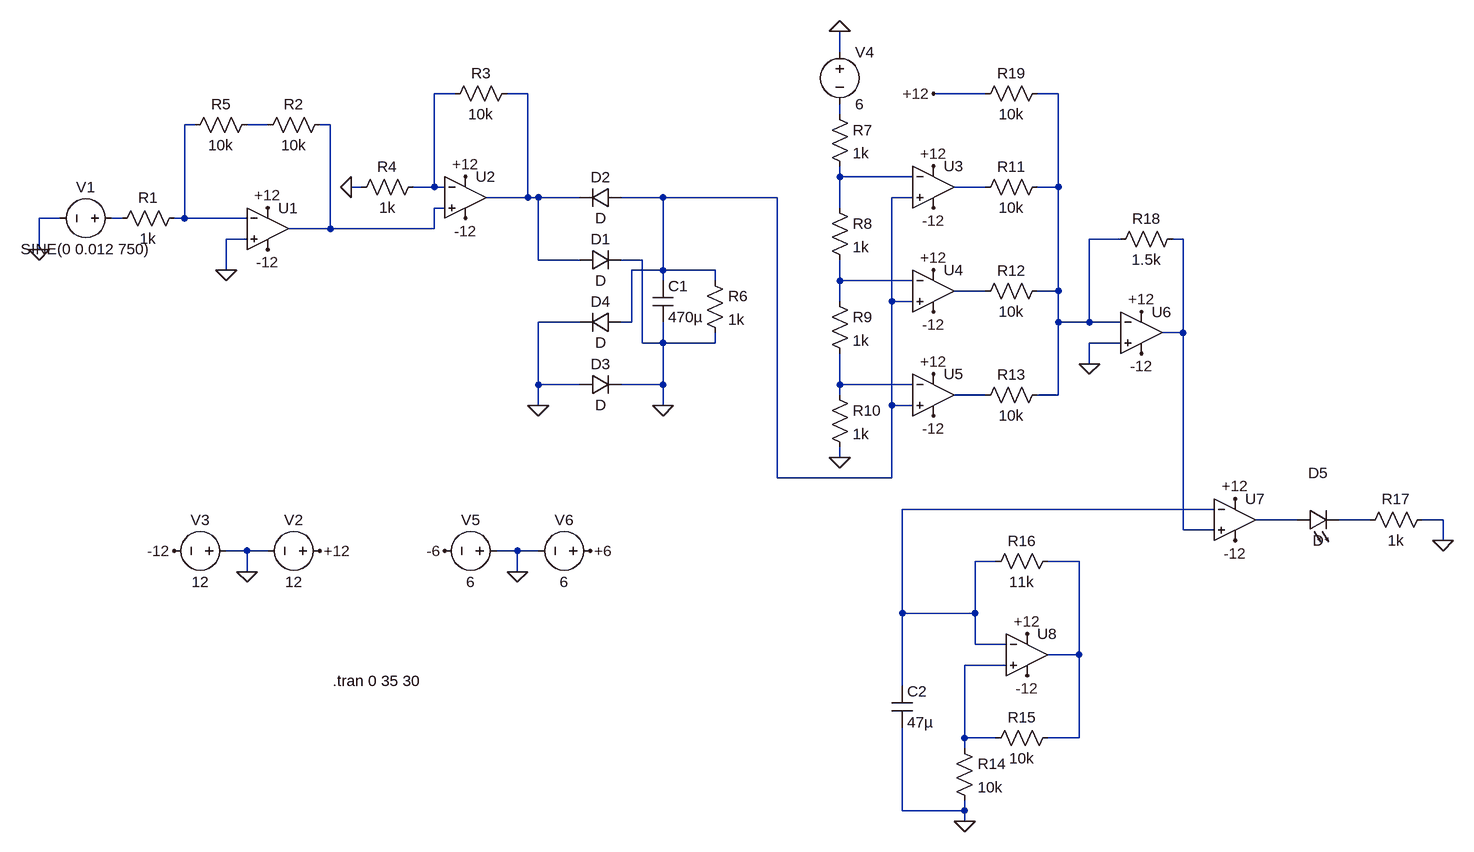
[diagram p0: schematic term project.asc]
term project.asc, the LTspice schematic file:
Version 4
SHEET 1 1892 1012
WIRE 944 -192 944 -224
WIRE 352 -128 320 -128
WIRE 464 -128 432 -128
WIRE 1168 -128 1088 -128
WIRE 1280 -128 1248 -128
WIRE 944 -96 944 -112
WIRE -48 -80 -64 -80
WIRE 64 -80 32 -80
WIRE 160 -80 144 -80
WIRE 944 0 944 -16
WIRE 1056 0 944 0
WIRE 208 16 192 16
WIRE 320 16 320 -128
WIRE 320 16 288 16
WIRE 336 16 320 16
WIRE 1168 16 1120 16
WIRE 1280 16 1280 -128
WIRE 1280 16 1248 16
WIRE 464 32 464 -128
WIRE 464 32 400 32
WIRE 480 32 464 32
WIRE 544 32 480 32
WIRE 672 32 608 32
WIRE 848 32 672 32
WIRE 1056 32 1024 32
WIRE 336 48 320 48
WIRE 944 48 944 0
WIRE -256 64 -288 64
WIRE -160 64 -176 64
WIRE -64 64 -64 -80
WIRE -64 64 -80 64
WIRE 32 64 -64 64
WIRE 160 80 160 -80
WIRE 160 80 96 80
WIRE 320 80 320 48
WIRE 320 80 160 80
WIRE 32 96 0 96
WIRE 1376 96 1328 96
WIRE 1472 96 1456 96
WIRE -288 112 -288 64
WIRE 480 128 480 32
WIRE 544 128 480 128
WIRE 640 128 608 128
WIRE 0 144 0 96
WIRE 672 144 672 32
WIRE 672 144 624 144
WIRE 752 144 672 144
WIRE 672 160 672 144
WIRE 752 160 752 144
WIRE 944 160 944 128
WIRE 1056 160 944 160
WIRE 1168 176 1120 176
WIRE 1280 176 1280 16
WIRE 1280 176 1248 176
WIRE 944 192 944 160
WIRE 1024 192 1024 32
WIRE 1056 192 1024 192
WIRE 544 224 480 224
WIRE 624 224 624 144
WIRE 624 224 608 224
WIRE 1280 224 1280 176
WIRE 1328 224 1328 96
WIRE 1328 224 1280 224
WIRE 1376 224 1328 224
WIRE 1472 240 1472 96
WIRE 1472 240 1440 240
WIRE 640 256 640 128
WIRE 672 256 672 224
WIRE 672 256 640 256
WIRE 752 256 752 240
WIRE 752 256 672 256
WIRE 1376 256 1328 256
WIRE 1328 288 1328 256
WIRE 480 320 480 224
WIRE 544 320 480 320
WIRE 672 320 672 256
WIRE 672 320 608 320
WIRE 944 320 944 272
WIRE 1056 320 944 320
WIRE 944 336 944 320
WIRE 1168 336 1120 336
WIRE 1280 336 1280 224
WIRE 1280 336 1248 336
WIRE 480 352 480 320
WIRE 672 352 672 320
WIRE 1024 352 1024 192
WIRE 1056 352 1024 352
WIRE 944 432 944 416
WIRE 848 464 848 32
WIRE 1024 464 1024 352
WIRE 1024 464 848 464
WIRE 1520 512 1040 512
WIRE 1648 528 1584 528
WIRE 1760 528 1712 528
WIRE 1872 528 1840 528
WIRE 1472 544 1472 240
WIRE 1520 544 1472 544
WIRE 1872 560 1872 528
WIRE 32 576 0 576
WIRE 64 576 32 576
WIRE 448 576 416 576
WIRE 480 576 448 576
WIRE 1184 592 1152 592
WIRE 1312 592 1264 592
WIRE 32 608 32 576
WIRE 448 608 448 576
WIRE 1040 672 1040 512
WIRE 1152 672 1152 592
WIRE 1152 672 1040 672
WIRE 1152 720 1152 672
WIRE 1200 720 1152 720
WIRE 1312 736 1312 592
WIRE 1312 736 1264 736
WIRE 1200 752 1136 752
WIRE 1040 784 1040 672
WIRE 1136 864 1136 752
WIRE 1184 864 1136 864
WIRE 1312 864 1312 736
WIRE 1312 864 1264 864
WIRE 1136 880 1136 864
WIRE 1040 976 1040 848
WIRE 1136 976 1136 960
WIRE 1136 976 1040 976
WIRE 1136 992 1136 976
FLAG -288 112 0
FLAG 192 16 0
FLAG 0 144 0
FLAG 32 608 0
FLAG 144 576 +12
FLAG 368 0 +12
FLAG 64 48 +12
FLAG -80 576 -12
FLAG 368 64 -12
FLAG 64 112 -12
FLAG 480 352 0
FLAG 672 352 0
FLAG 944 432 0
FLAG 944 -224 0
FLAG 1088 -16 +12
FLAG 1088 144 +12
FLAG 1088 304 +12
FLAG 1088 368 -12
FLAG 1088 208 -12
FLAG 1088 48 -12
FLAG 1328 288 0
FLAG 1136 992 0
FLAG 1232 768 -12
FLAG 1232 704 +12
FLAG 1552 496 +12
FLAG 448 608 0
FLAG 560 576 +6
FLAG 336 576 -6
FLAG 1408 272 -12
FLAG 1408 208 +12
FLAG 1552 560 -12
FLAG 1872 560 0
FLAG 1088 -128 +12
SYMBOL voltage -160 64 R90
WINDOW 0 -32 56 VBottom 2
WINDOW 3 32 56 VTop 2
WINDOW 123 0 0 Left 0
WINDOW 39 0 0 Left 0
SYMATTR InstName V1
SYMATTR Value SINE(0 0.012 750)
SYMBOL Opamps\\UniversalOpamp2 64 80 R0
SYMATTR InstName U1
SYMBOL Opamps\\UniversalOpamp2 368 32 R0
SYMATTR InstName U2
SYMBOL res -64 48 R90
WINDOW 0 0 56 VBottom 2
WINDOW 3 32 56 VTop 2
SYMATTR InstName R1
SYMATTR Value 1k
SYMBOL res 160 -96 R90
WINDOW 0 0 56 VBottom 2
WINDOW 3 32 56 VTop 2
SYMATTR InstName R2
SYMATTR Value 10k
SYMBOL res 448 -144 R90
WINDOW 0 0 56 VBottom 2
WINDOW 3 32 56 VTop 2
SYMATTR InstName R3
SYMATTR Value 10k
SYMBOL res 304 0 R90
WINDOW 0 0 56 VBottom 2
WINDOW 3 32 56 VTop 2
SYMATTR InstName R4
SYMATTR Value 1k
SYMBOL voltage 160 576 R90
WINDOW 0 -32 56 VBottom 2
WINDOW 3 32 56 VTop 2
SYMATTR InstName V2
SYMATTR Value 12
SYMBOL voltage 16 576 R90
WINDOW 0 -32 56 VBottom 2
WINDOW 3 32 56 VTop 2
SYMATTR InstName V3
SYMATTR Value 12
SYMBOL res 48 -96 R90
WINDOW 0 0 56 VBottom 2
WINDOW 3 32 56 VTop 2
SYMATTR InstName R5
SYMATTR Value 10k
SYMBOL diode 544 144 R270
WINDOW 0 32 32 VTop 2
WINDOW 3 0 32 VBottom 2
SYMATTR InstName D1
SYMBOL diode 608 16 R90
WINDOW 0 0 32 VBottom 2
WINDOW 3 32 32 VTop 2
SYMATTR InstName D2
SYMBOL diode 544 336 R270
WINDOW 0 32 32 VTop 2
WINDOW 3 0 32 VBottom 2
SYMATTR InstName D3
SYMBOL diode 608 208 R90
WINDOW 0 0 32 VBottom 2
WINDOW 3 32 32 VTop 2
SYMATTR InstName D4
SYMBOL cap 656 160 R0
SYMATTR InstName C1
SYMATTR Value 470µ
SYMBOL res 736 144 R0
SYMATTR InstName R6
SYMATTR Value 1k
SYMBOL voltage 944 -208 R0
WINDOW 123 0 0 Left 0
WINDOW 39 0 0 Left 0
SYMATTR InstName V4
SYMATTR Value 6
SYMBOL Opamps\\UniversalOpamp2 1088 16 R0
SYMATTR InstName U3
SYMBOL Opamps\\UniversalOpamp2 1088 176 R0
SYMATTR InstName U4
SYMBOL Opamps\\UniversalOpamp2 1088 336 R0
SYMATTR InstName U5
SYMBOL res 928 -112 R0
SYMATTR InstName R7
SYMATTR Value 1k
SYMBOL res 928 32 R0
SYMATTR InstName R8
SYMATTR Value 1k
SYMBOL res 928 176 R0
SYMATTR InstName R9
SYMATTR Value 1k
SYMBOL res 928 320 R0
SYMATTR InstName R10
SYMATTR Value 1k
SYMBOL res 1264 0 R90
WINDOW 0 0 56 VBottom 2
WINDOW 3 32 56 VTop 2
SYMATTR InstName R11
SYMATTR Value 10k
SYMBOL res 1264 160 R90
WINDOW 0 0 56 VBottom 2
WINDOW 3 32 56 VTop 2
SYMATTR InstName R12
SYMATTR Value 10k
SYMBOL res 1264 320 R90
WINDOW 0 0 56 VBottom 2
WINDOW 3 32 56 VTop 2
SYMATTR InstName R13
SYMATTR Value 10k
SYMBOL Opamps\\UniversalOpamp2 1408 240 R0
SYMATTR InstName U6
SYMBOL Opamps\\UniversalOpamp2 1552 528 R0
SYMATTR InstName U7
SYMBOL Opamps\\UniversalOpamp2 1232 736 R0
SYMATTR InstName U8
SYMBOL res 1120 864 R0
SYMATTR InstName R14
SYMATTR Value 10k
SYMBOL res 1280 848 R90
WINDOW 0 0 56 VBottom 2
WINDOW 3 32 56 VTop 2
SYMATTR InstName R15
SYMATTR Value 10k
SYMBOL res 1280 576 R90
WINDOW 0 0 56 VBottom 2
WINDOW 3 32 56 VTop 2
SYMATTR InstName R16
SYMATTR Value 11k
SYMBOL cap 1024 784 R0
SYMATTR InstName C2
SYMATTR Value 47µ
SYMBOL voltage 432 576 R90
WINDOW 0 -32 56 VBottom 2
WINDOW 3 32 56 VTop 2
SYMATTR InstName V5
SYMATTR Value 6
SYMBOL voltage 576 576 R90
WINDOW 0 -32 56 VBottom 2
WINDOW 3 32 56 VTop 2
SYMATTR InstName V6
SYMATTR Value 6
SYMBOL LED 1648 544 R270
WINDOW 0 72 32 VTop 2
WINDOW 3 0 32 VBottom 2
SYMATTR InstName D5
SYMBOL res 1856 512 R90
WINDOW 0 0 56 VBottom 2
WINDOW 3 32 56 VTop 2
SYMATTR InstName R17
SYMATTR Value 1k
SYMBOL res 1472 80 R90
WINDOW 0 0 56 VBottom 2
WINDOW 3 32 56 VTop 2
SYMATTR InstName R18
SYMATTR Value 1.5k
SYMBOL res 1264 -144 R90
WINDOW 0 0 56 VBottom 2
WINDOW 3 32 56 VTop 2
SYMATTR InstName R19
SYMATTR Value 10k
TEXT 164 776 Left 2 !.tran 0 35 30

The netlist it stands for:
* term project.asc
V1 N011 0 SINE(0 0.012 750)
XU1 0 N005 +12 -12 N007 level.2 Avol=1Meg GBW=10Meg Slew=10Meg ilimit=25m rail=0 Vos=0 phimargin=45 en=0 enk=0 in=0 ink=0 Rin=500Meg  ; pins IN+ IN- V+ V- OUT
XU2 N007 N001 +12 -12 N002 level.2 Avol=1Meg GBW=10Meg Slew=10Meg ilimit=25m rail=0 Vos=0 phimargin=45 en=0 enk=0 in=0 ink=0 Rin=500Meg  ; pins IN+ IN- V+ V- OUT
R1 N005 N011 1k
R2 N007 N006 10k
R3 N002 N001 10k
R4 N001 0 1k
V2 +12 0 12
V3 0 -12 12
R5 N006 N005 10k
D1 N002 0 D
D2 N010 N002 D
D3 0 0 D
D4 N010 0 D
C1 N010 0 470µ
R6 N010 0 1k
V4 0 N004 6
XU3 N010 N008 +12 -12 N009 level.2 Avol=1Meg GBW=10Meg Slew=10Meg ilimit=25m rail=0 Vos=0 phimargin=45 en=0 enk=0 in=0 ink=0 Rin=500Meg  ; pins IN+ IN- V+ V- OUT
XU4 N010 N013 +12 -12 N014 level.2 Avol=1Meg GBW=10Meg Slew=10Meg ilimit=25m rail=0 Vos=0 phimargin=45 en=0 enk=0 in=0 ink=0 Rin=500Meg  ; pins IN+ IN- V+ V- OUT
XU5 N010 N015 +12 -12 N016 level.2 Avol=1Meg GBW=10Meg Slew=10Meg ilimit=25m rail=0 Vos=0 phimargin=45 en=0 enk=0 in=0 ink=0 Rin=500Meg  ; pins IN+ IN- V+ V- OUT
R7 N004 N008 1k
R8 N008 N013 1k
R9 N013 N015 1k
R10 N015 0 1k
R11 N003 N009 10k
R12 N003 N014 10k
R13 N003 N016 10k
XU6 0 N003 +12 -12 N012 level.2 Avol=1Meg GBW=10Meg Slew=10Meg ilimit=25m rail=0 Vos=0 phimargin=45 en=0 enk=0 in=0 ink=0 Rin=500Meg  ; pins IN+ IN- V+ V- OUT
XU7 N012 N017 +12 -12 N018 level.2 Avol=1Meg GBW=10Meg Slew=10Meg ilimit=25m rail=0 Vos=0 phimargin=45 en=0 enk=0 in=0 ink=0 Rin=500Meg  ; pins IN+ IN- V+ V- OUT
XU8 N021 N017 +12 -12 N020 level.2 Avol=1Meg GBW=10Meg Slew=10Meg ilimit=25m rail=0 Vos=0 phimargin=45 en=0 enk=0 in=0 ink=0 Rin=500Meg  ; pins IN+ IN- V+ V- OUT
R14 N021 0 10k
R15 N020 N021 10k
R16 N020 N017 11k
C2 N017 0 47µ
V5 0 -6 6
V6 +6 0 6
D5 N018 N019 D
R17 0 N019 1k
R18 N012 N003 1.5k
R19 N003 +12 10k
.model D D
.lib standard.dio
.tran 0 35 30
.lib UniversalOpamps2.sub
.backanno
.end